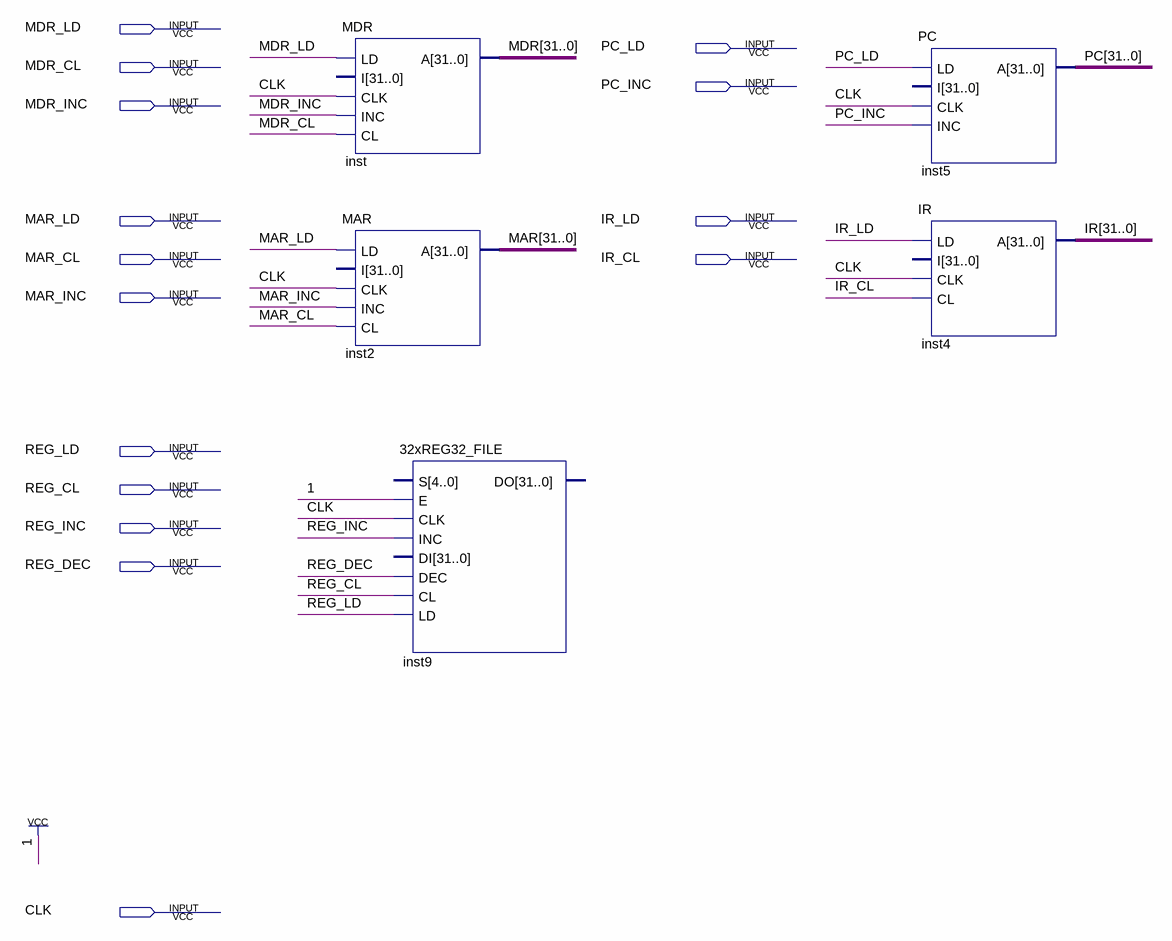
[diagram p0: schematic sheet]
// Quartus schematic DataPath.bdf as structural Verilog: 5 symbols, 15 pins
module DataPath (
  input  MDR_LD,
  input  PC_LD,
  input  MDR_CL,
  input  PC_INC,
  input  MDR_INC,
  input  MAR_LD,
  input  IR_LD,
  input  MAR_CL,
  input  IR_CL,
  input  MAR_INC,
  input  REG_LD,
  input  REG_CL,
  input  REG_INC,
  input  REG_DEC,
  input  CLK
);

  wire [31:0] IR, MAR, MDR, PC;

  MDR inst (.LD(MDR_LD), .CLK(CLK), .INC(MDR_INC), .CL(MDR_CL), .A(MDR));  // open: I
  MAR inst2 (.LD(MAR_LD), .CLK(CLK), .INC(MAR_INC), .CL(MAR_CL), .A(MAR));  // open: I
  \32xREG32_FILE  inst9 (
    .E(1'b1), .CLK(CLK), .INC(REG_INC), .DEC(REG_DEC), .CL(REG_CL), .LD(REG_LD));  // open: S, DI, DO
  PC inst5 (.LD(PC_LD), .CLK(CLK), .INC(PC_INC), .A(PC));  // open: I
  IR inst4 (.LD(IR_LD), .CLK(CLK), .CL(IR_CL), .A(IR));  // open: I
endmodule
